# EAGLE design Pakfav7 (EAGLE 9.0.1)
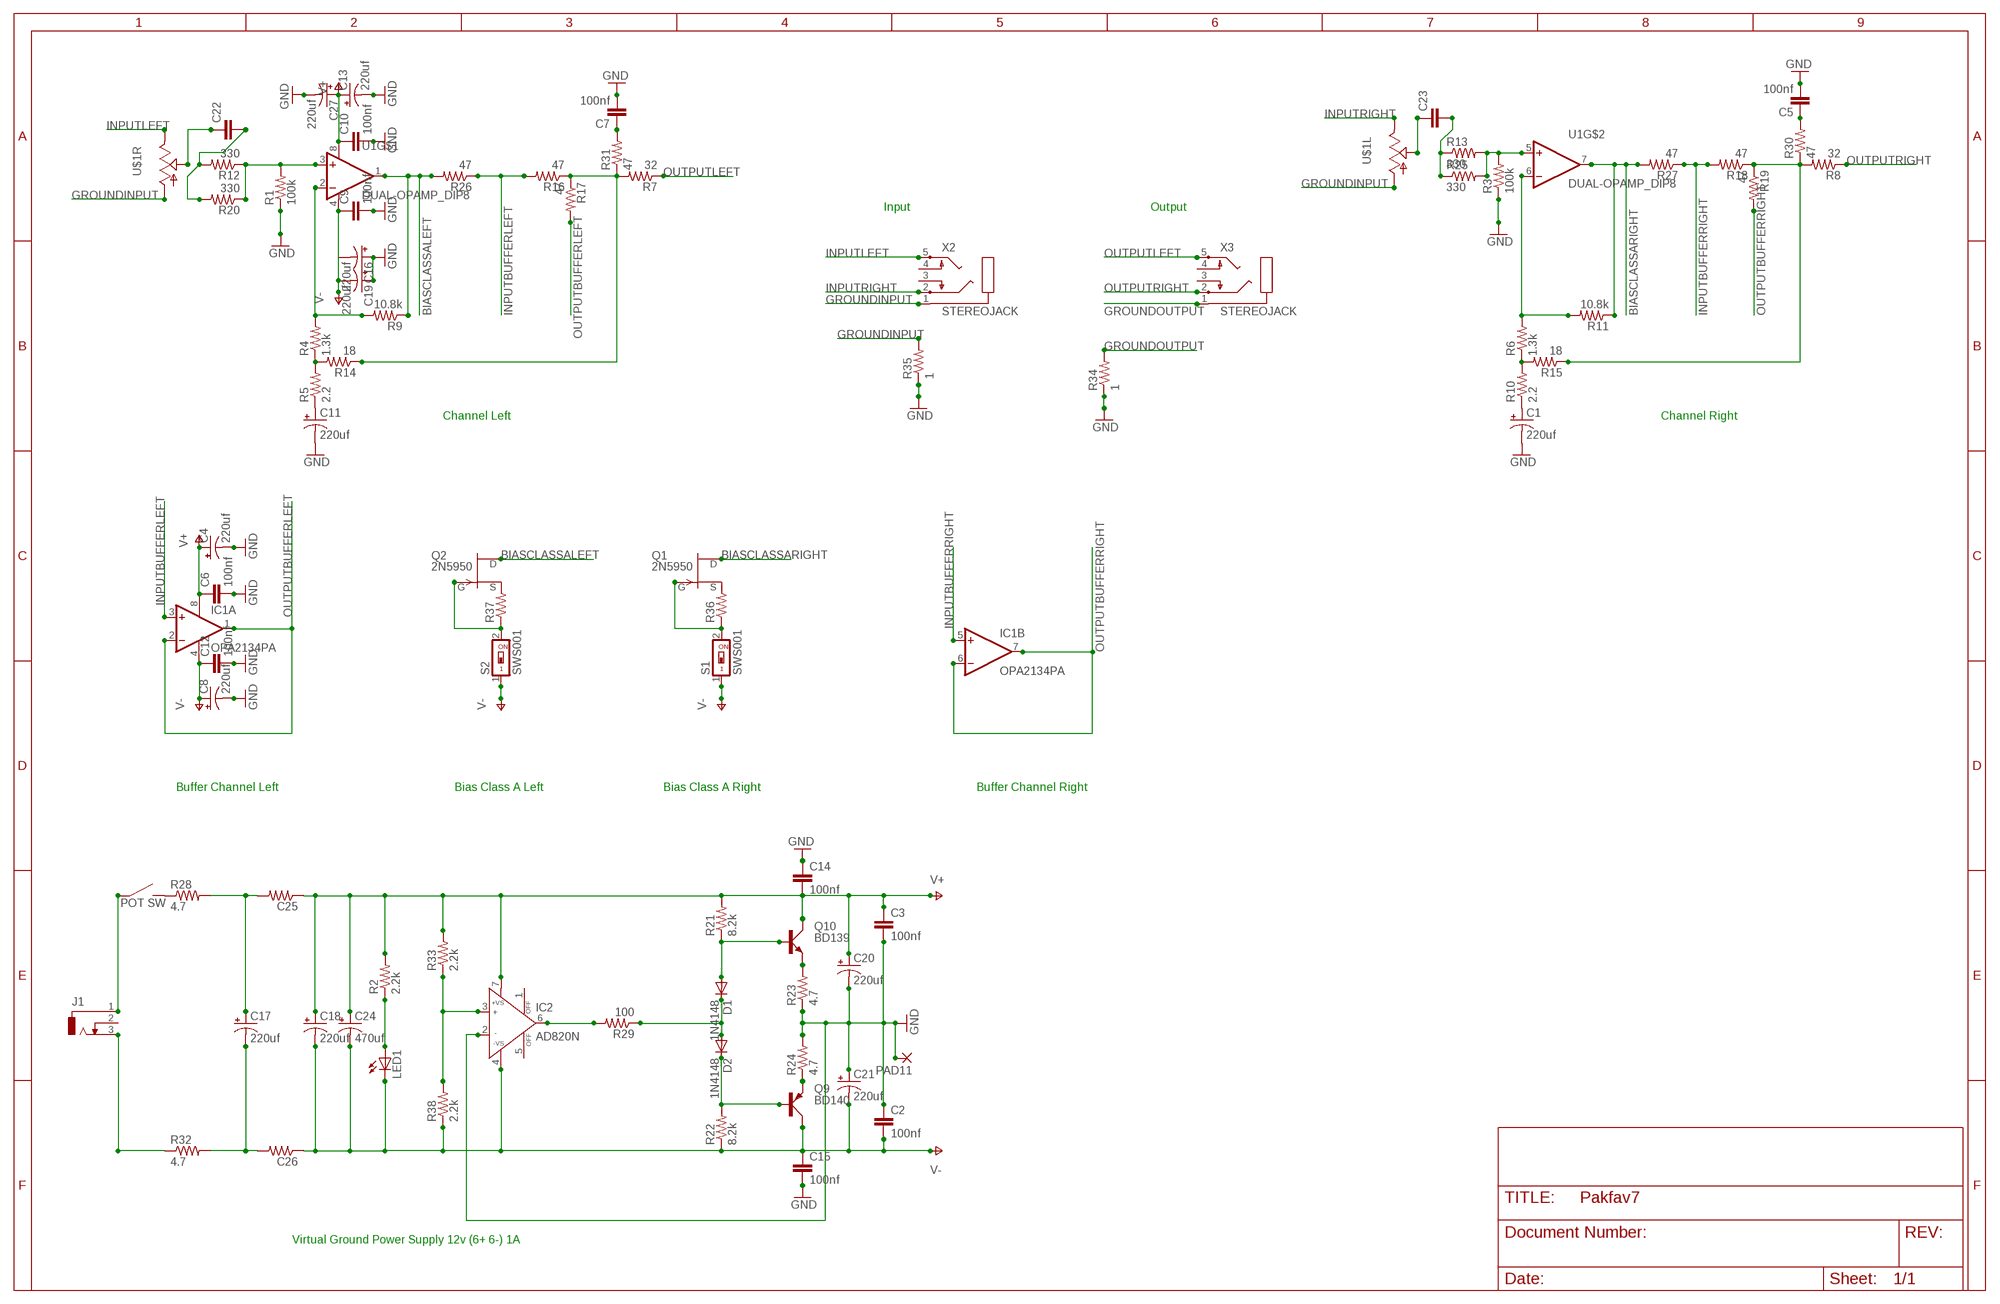
[diagram p0: schematic, sheet 1]

## Parts
C1  220uf  CPOL-USE5-10.5  [E5-10,5]
C2  100nf  C5/2.5  [C5B2.5]
C3  100nf  C5/2.5  [C5B2.5]
C4  220uf  CPOL-USE5-10.5  [E5-10,5]
C5  100nf  C5/2.5  [C5B2.5]
C6  100nf  C5/2.5  [C5B2.5]
C7  100nf  C5/2.5  [C5B2.5]
C8  220uf  CPOL-USE5-10.5  [E5-10,5]
C9  100nf  C5/2.5  [C5B2.5]
C10  100nf  C5/2.5  [C5B2.5]
C11  220uf  CPOL-USE5-10.5  [E5-10,5]
C12  100nf  C5/2.5  [C5B2.5]
C13  220uf  CPOL-USE5-10.5  [E5-10,5]
C14  100nf  C5/2.5  [C5B2.5]
C15  100nf  C5/2.5  [C5B2.5]
C16  220uf  CPOL-USE5-10.5  [E5-10,5]
C17  220uf  CPOL-USE3.5-10  [E3,5-10]
C18  220uf  CPOL-USE3.5-10  [E3,5-10]
C19  220uf  CPOL-USE5-10.5  [E5-10,5]
C20  220uf  CPOL-USD/7343-31R  [D/7343-31R]
C21  220uf  CPOL-USD/7343-31R  [D/7343-31R]
C22  C22/6  [C22.5B6]
C23  C22/6  [C22.5B6]
C24  470uf  CPOL-USE5-10.5  [E5-10,5]
C25  R-US_0207/12  [0207/12]
C26  R-US_0207/12  [0207/12]
C27  220uf  CPOL-USE5-10.5  [E5-10,5]
D1  1N4148  1N4148DO35-7  [DO35-7]
D2  1N4148  1N4148DO35-7  [DO35-7]
IC1  OPA2134PA  [DIL08]
IC2  AD820N  [DIL08]
J1  DCJ0303  [DCJ0303]
LED1  LED3MM  [LED3MM]
PAD11  1,6/0,9  [1,6/0,9]
Q1  2N5950  [TO-92]
Q2  2N5950  [TO-92]
Q9  BD140  [TO126AV]
Q10  BD139  [TO126AV]
R1  100k  R-US_0207/10  [0207/10]
R2  2.2k  R-US_0207/10  [0207/10]
R3  100k  R-US_0207/10  [0207/10]
R4  1.3k  R-US_0207/10  [0207/10]
R5  2.2  R-US_0204/5  [0204/5]
R6  1.3k  R-US_0207/10  [0207/10]
R7  32  R-US_0207/12  [0207/12]
R8  32  R-US_0207/12  [0207/12]
R9  10.8k  R-US_0207/10  [0207/10]
R10  2.2  R-US_0204/5  [0204/5]
R11  10.8k  R-US_0207/10  [0207/10]
R12  330  R-US_0207/10  [0207/10]
R13  330  R-US_0207/10  [0207/10]
R14  18  R-US_0207/12  [0207/12]
R15  18  R-US_0207/12  [0207/12]
R16  47  R-US_0207/12  [0207/12]
R17  47  R-US_0207/12  [0207/12]
R18  47  R-US_0207/12  [0207/12]
R19  47  R-US_0207/12  [0207/12]
R20  330  R-US_0207/10  [0207/10]
R21  8.2k  R-US_0207/10  [0207/10]
R22  8.2k  R-US_0207/10  [0207/10]
R23  4.7  R-US_0207/10  [0207/10]
R24  4.7  R-US_0207/10  [0207/10]
R25  330  R-US_0207/10  [0207/10]
R26  47  R-US_0207/10  [0207/10]
R27  47  R-US_0207/10  [0207/10]
R28  4.7  R-US_0207/10  [0207/10]
R29  100  R-US_0207/10  [0207/10]
R30  47  R-US_0207/7  [0207/7]
R31  47  R-US_0207/7  [0207/7]
R32  4.7  R-US_0207/10  [0207/10]
R33  2.2k  R-US_0207/10  [0207/10]
R34  1  R-US_0207/7  [0207/7]
R35  1  R-US_0207/7  [0207/7]
R36  R-US_0204/5  [0204/5]
R37  R-US_0204/5  [0204/5]
R38  2.2k  R-US_0207/10  [0207/10]
S1  SWS001  [SMS-001]
S2  SWS001  [SMS-001]
U1  DUAL-OPAMP_DIP8  [DIP-8]
U$1  ALPS_RK0971221Z05  [ALPS_RK0971221Z0X]
X2  STEREOJACK  [STX3100]
X3  STEREOJACK  [STX3100]

## Nets
BIASCLASSALEFT: Q2.3(D) R9.1 R26.2 U1.1(OUT)
BIASCLASSARIGHT: Q1.3(D) R11.1 R27.2 U1.7(OUT)
GND: C1.- C2.1 C3.2 C4.- C5.2 C6.2 C7.2 C8.- C9.2 C10.2 C11.- C12.2 C13.- C14.1 C15.2 C16.+ C19.+ C20.- C21.+ C27.- IC2.2(IN-) PAD11.1(P) R1.1 R3.1 R23.1 R24.2 R34.1 R35.1
GROUNDINPUT: R35.2 U$1.G1 U$1.G2 X2.1
GROUNDOUTPUT: R34.2 X3.1
INPUTBUFFERLEFT: IC1.3(A:+IN) R16.2 R26.1
INPUTBUFFERRIGHT: IC1.5(B:+IN) R18.2 R27.1
INPUTLEFT: U$1.I2 X2.5
INPUTRIGHT: U$1.I1 X2.2
N$1: R1.2 R12.1 R20.1 U1.3(+IN)
N$2: C1.+ R10.1
N$3: C22.2 R12.2 R20.2
N$4: C11.+ R5.1
N$5: IC2.6(OUT) R29.2
N$6: Q10.E R23.2
N$7: IC2.3(IN+) R33.1 R38.2
N$8: Q9.E R24.1
N$9: C22.1 U$1.O2
N$10: R3.2 R13.2 R25.2 U1.5(+IN)
N$11: C23.2 R13.1 R25.1
N$12: R4.1 R5.2 R14.2
N$13: R4.2 R9.2 U1.2(-IN)
N$14: R6.1 R10.2 R15.2
N$15: C23.1 U$1.O1
N$18: R6.2 R11.2 U1.6(-IN)
N$21: R28.1 U$1.S2
N$22: J1.3 R32.1
N$23: R8.2 R15.1 R18.1 R19.1 R30.1
N$24: R7.2 R14.1 R16.1 R17.1 R31.1
N$25: LED1.A R2.1
N$26: J1.1 U$1.S1
N$28: C5.1 R30.2
N$29: D1.A Q10.B R21.1
N$30: D2.C Q9.B R22.2
N$33: C17.+ C25.2 R28.2
N$36: D1.C D2.A R29.1
N$37: C7.1 R31.2
N$40: C17.- C26.2 R32.2
N$41: Q1.2(S) R36.2
N$43: Q2.1(G) R37.1 S2.2
N$44: Q1.1(G) R36.1 S1.2
N$45: Q2.2(S) R37.2
OUTPUTBUFFERLEFT: IC1.1(A:OUT) IC1.2(A:-IN) R17.2
OUTPUTBUFFERRIGHT: IC1.6(B:-IN) IC1.7(B:OUT) R19.2
OUTPUTLEFT: R7.1 X3.5
OUTPUTRIGHT: R8.1 X3.2
V+: C3.1 C4.+ C6.1 C10.1 C13.+ C14.2 C18.+ C20.+ C24.+ C25.1 C27.+ IC1.8(A:V+) IC2.7(+VS) Q10.C R2.2 R21.2 R33.2 U1.8(V+)
V-: C2.2 C8.+ C9.1 C12.1 C15.1 C16.- C18.- C19.- C21.- C24.- C26.1 IC1.4(A:V-) IC2.4(-VS) LED1.K(C) Q9.C R22.1 R38.1 S1.1 S2.1 U1.4(V-)
Unconnected: IC2.1(OFF) IC2.5(OFF) J1.2 X2.3 X2.4 X3.3 X3.4

## Notes on the sheet
- Input | Output
- Channel Left | Channel Right
- Buffer Channel Left | Bias Class A Left | Bias Class A Right | Buffer Channel Right
- Virtual Ground Power Supply 12v (6+ 6-) 1A

## Library data of the parts
C1 C4 C8 C11 C13 C16-C21 C24 C27 = rcl:CPOL-US: POLARIZED CAPACITOR, American symbol; SPICEPREFIX: C
C2 C3 C5-C7 C9 C10 C12 C14 C15 C22 C23 = capacitor-wima:C: CAPACITOR naming: grid - package width
C25 C26 R1 R3-R6 R9-R13 R20 R25 R30 R31 R34 R35 = resistor:R-US_: RESISTOR, American symbol
D1 D2 = diode:1N4148: DIODE high speed (Philips)
IC1 = linear:OPA2*: Dual Operational Amplifier Low Power, Single-Supply, Rail-To-Rail Operational Amplifier Source: http://focus.ti.com/lit/ds/symlink/opa2345.pdf http://focus.ti.com .. opa241.pdf http://focus.ti.com/lit/ds/symlink/opa2134.pdf
IC2 = analog-devices:AD820N: Single-Supply, Rail-to-Rail, Low Power, FET Input Op Amp Source: http://www.analog.com/static/imported-files/data_sheets/AD820.pdf; OC_FARNELL: 1438579; OC_NEWARK: unknown
J1 = con-jack:DCJ0303: DC POWER JACK Source: DCJ0303.pdf
LED1 = led:LED: LED OSRAM: - CHIPLED LG R971, LG N971, LY N971, LG Q971, LY Q971, LO R971, LY R971 LH N974, LH R974 LS Q976, LO Q976, LY Q976 LO Q996 - Hyper CHIPLED LW Q18S LB Q993, LB Q99A, LB R99A - SideLED LS A670, LO A670, LY A670, LG A670, LP A670 LB A673, LV A673, LT A673, LW A673 LH A674 LY A675 LS A676, LA A676, LO A676, LY A676, LW A676 LS A679, LY A679, LG A679 - Hyper Micro SIDELED® LS Y876, LA Y876, LO Y876, LY Y876 LT Y87S - SmartLED LW L88C, LW L88S LB L89C, LB L89S, LG L890 LS L89K, LO L89K, LY L89K LS L896, LA L896, LO L896, LY L896 - TOPLED LS T670, LO T670, LY T670, LG T670, LP T670 LSG T670, LSP T670, LSY T670, LOP T670, LYG T670 LG T671, LOG T671, LSG T671 LB T673, LV T673, LT T673, LW T673 LH T674 LS T676, LA T676, LO T676, LY T676, LB T676, LH T676, LSB T676, LW T676 LB T67C, LV T67C, LT T67C, LS T67K, LO T67K, LY T67K, LW E67C LS E67B, LA E67B, LO E67B, LY E67B, LB E67C, LV E67C, LT E67C LW T67C LS T679, LY T679, LG T679 LS T770, LO T770, LY T770, LG T770, LP T770 LB T773, LV T773, LT T773, LW T773 LH T774 LS E675, LA E675, LY E675, LS T675 LS T776, LA T776, LO T776, LY T776, LB T776 LHGB T686 LT T68C, LB T68C - Hyper Mini TOPLED® LB M676 - Mini TOPLED Santana® LG M470 LS M47K, LO M47K, LY M47K Source: http://www.osram.convergy.de LUXEON: - LUMILED® LXK2-PW12-R00, LXK2-PW12-S00, LXK2-PW14-U00, LXK2-PW14-V00 LXK2-PM12-R00, LXK2-PM12-S00, LXK2-PM14-U00 LXK2-PE12-Q00, LXK2-PE12-R00, LXK2-PE12-S00, LXK2-PE14-T00, LXK2-PE14-U00 LXK2-PB12-K00, LXK2-PB12-L00, LXK2-PB12-M00, LXK2-PB14-N00, LXK2-PB14-P00, LXK2-PB14-Q00 LXK2-PR12-L00, LXK2-PR12-M00, LXK2-PR14-Q00, LXK2-PR14-R00 LXK2-PD12-Q00, LXK2-PD12-R00, LXK2-PD12-S00 LXK2-PH12-R00, LXK2-PH12-S00 LXK2-PL12-P00, LXK2-PL12-Q00, LXK2-PL12-R00 Source: www.luxeon.com KINGBRIGHT: KA-3528ASYC Source: www.kingbright.com
PAD11 = wirepad:1,6/0,9: THROUGH-HOLE PAD
Q1 Q2 = transistor-fet:2N5950: N-Channel JFET RF Amplifier
Q9 = transistor-power:BD140: PNP TRANSISTOR
Q10 = transistor-power:BD139: NPN TRANSISTOR
R2 R7 R8 R14-R19 R21-R24 R26-R29 R32 R33 R36-R38 = resistor@1:R-US_: RESISTOR, American symbol
S1 S2 = smd-special:SWS001: SMD Dip Switch 1 pol.
U1 = opamps:DUAL-OPAMP: Generic 2-channel DIP-8 opamp
U$1 = audio-pots:ALPS_RK0971221Z0*: ALPS RK0971221Z Dual-gang 9mm potentiometer for volume control, with SPST switch -05 model: 10K with "volume" taper -0N model: 50K with traditional audio taper
X2 X3 = adafruit:STEREOJACK: MIC/HEADPHONE JACK Stereo jack with two switches. Kycon STX3100, CUI SJ1-3555NG and/or 4UCon 05544

## Board
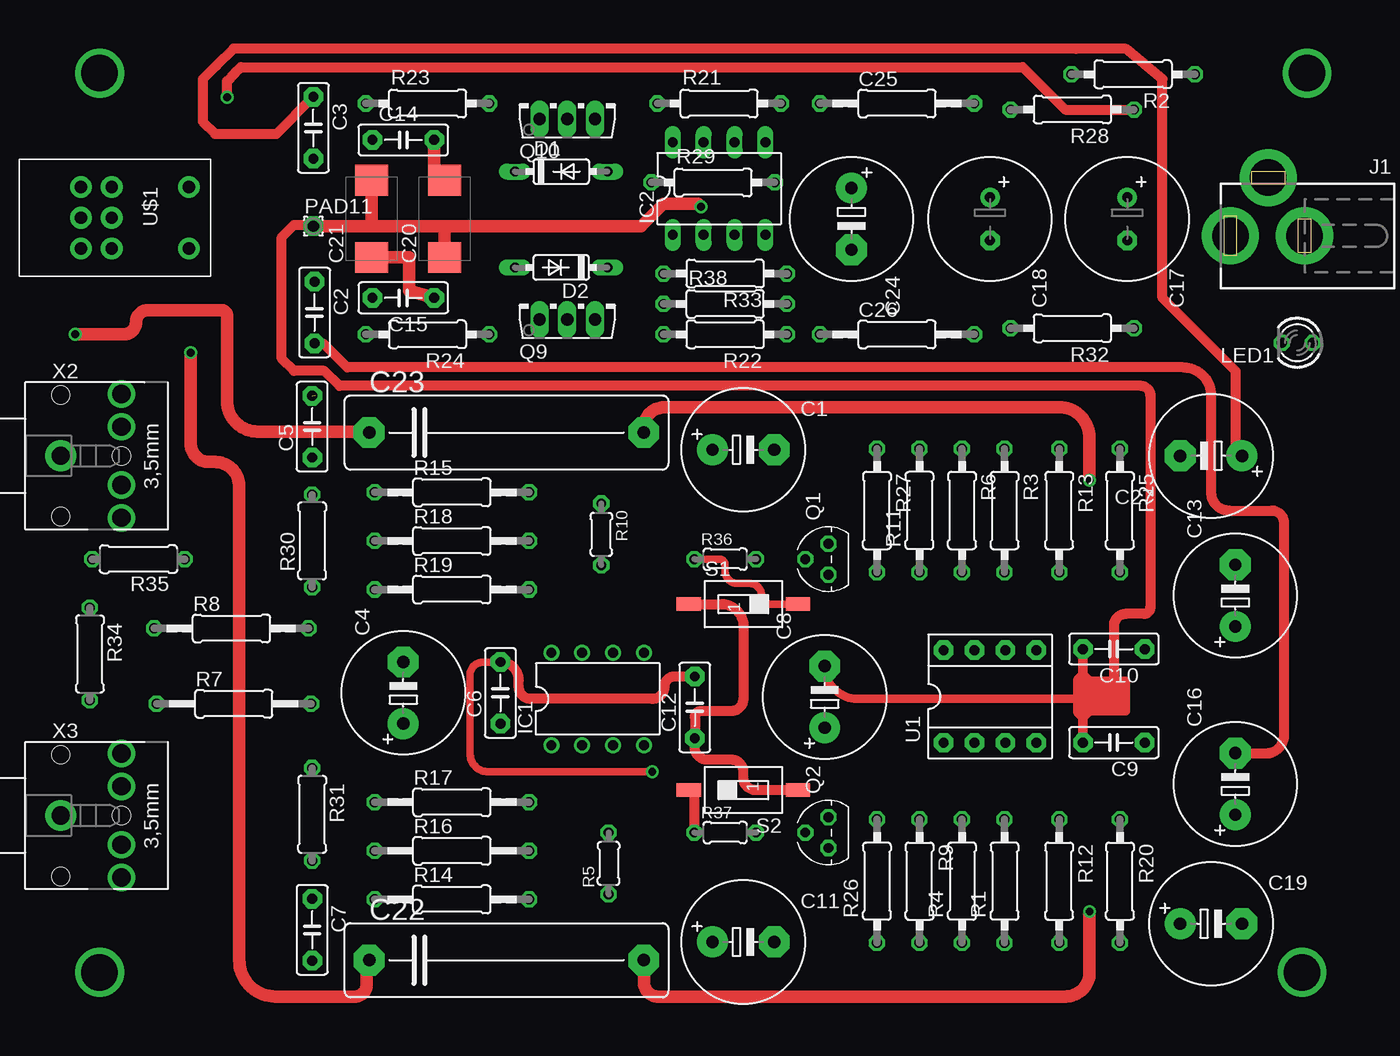
[diagram p1: board, top side]
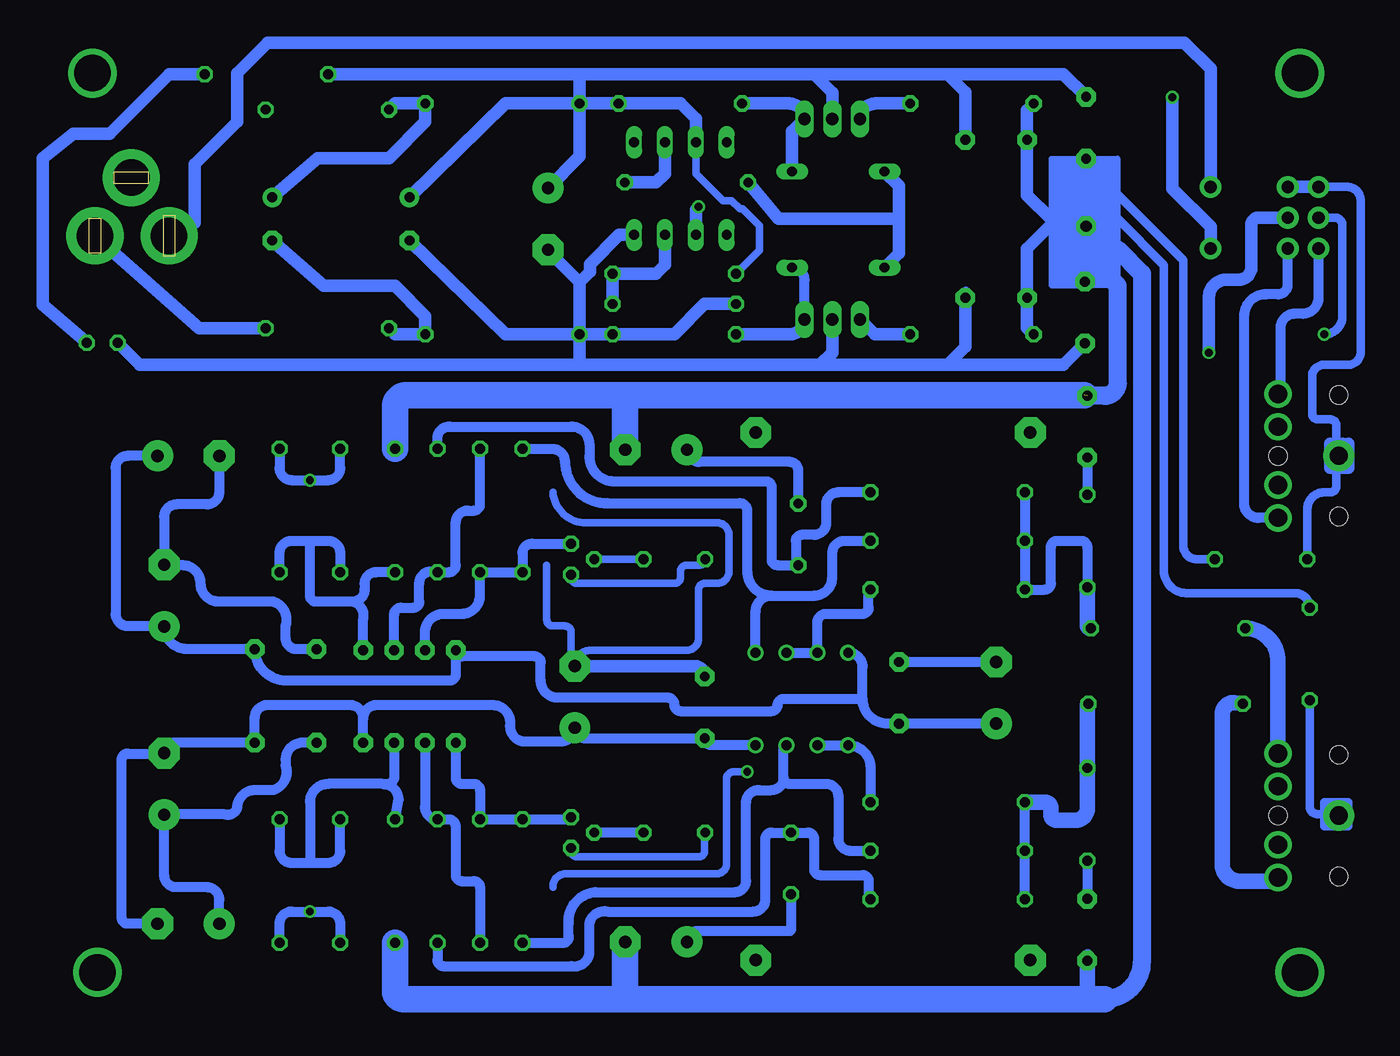
[diagram p2: board, bottom side, seen from below]

No outline drawn. Coordinates in mm, seen from the top.
Copper layers (1*16): Top 0.035mm / dielectric 1.5mm / Bottom 0.035mm
Design rules "default *": minimum track width 10mil, minimum drill 24mil, track to track 28mil, track to pad 28mil, pad to pad 28mil, via to via 28mil, smd to smd 8mil, copper to edge 40mil, drill to drill 8mil, minimum pad ring 10mil, minimum via ring 8mil, stop-mask expansion 4mil, vias tented up to drill 0mil, thermal gap 10mil

### Footprints (pad centres in the part's own frame; a part is rotated, then mirrored left to right if it is on the bottom)
E5-10,5 = drill 1.016 pad 2.54: + -2.54,0 | drill 1.016 pad 2.54 octagon: - 2.54,0
C5B2.5 = drill 0.813 pad 1.6 octagon: 1 -2.54,0; 2 2.54,0
E3,5-10 = drill 0.813 pad 1.6: + -1.778,0 | drill 0.813 pad 1.6 octagon: - 1.778,0
D/7343-31R = smd 2.55 x 2.7: + 3.175,0; - -3.175,0
C22.5B6 = drill 1.016 pad 2.54 octagon: 1 -11.303,0; 2 11.303,0
0207/12 = drill 0.813 octagon: 1 -6.35,0; 2 6.35,0
DO35-7 = drill 0.813 long: A 3.81,0; C -3.81,0
DIL08 = drill 0.813 pad 1.27: 1 -3.81,-3.81; 2 -1.27,-3.81; 3 1.27,-3.81; 4 3.81,-3.81; 5 3.81,3.81; 6 1.27,3.81; 7 -1.27,3.81; 8 -3.81,3.81
DIL08' = drill 0.813 long: 1 -3.81,-3.81; 2 -1.27,-3.81; 3 1.27,-3.81; 4 3.81,-3.81; 5 3.81,3.81; 6 1.27,3.81; 7 -1.27,3.81; 8 -3.81,3.81
DCJ0303 = drill 3 pad 4.7: 1 0,3.1; 2 4.8,0; 3 0,-3
LED3MM = drill 0.813 octagon: A -1.27,0; K 1.27,0
1,6/0,9 = drill 0.914 pad 1.6 octagon: 1 0,0
TO-92 = drill 0.813 octagon: 1 -1.27,0; 2 0,1.905; 3 1.27,0
TO126AV = drill 1.016 long: B 2.286,-1.27; C 0,-1.27; E -2.286,-1.27
0207/10 = drill 0.813 octagon: 1 -5.08,0; 2 5.08,0
0204/5 = drill 0.813 octagon: 1 -2.54,0; 2 2.54,0
0207/7 = drill 0.813 octagon: 1 -3.81,0; 2 3.81,0
SMS-001 = smd 1.092 x 2.007: 1 0,-4.496; 2 0,4.496
DIP-8 = drill 0.813 pad 1.6 octagon: 1 -3.81,3.81; 2 -3.81,1.27; 3 -3.81,-1.27; 4 -3.81,-3.81; 5 3.81,-3.81; 6 3.81,-1.27; 7 3.81,1.27; 8 3.81,3.81
ALPS_RK0971221Z0X = drill 1.016 pad 1.778: G1 2.54,-2.54; G2 0,-2.54; I1 2.54,2.54; I2 0,2.54; O1 2.54,0; O2 0,0; S1 -6.35,-2.54; S2 -6.35,2.54
STX3100 = drill 1.5 pad 2.54: 1 2.7,-0.1 | drill 1.5: 2 7.7,5; 3 7.7,2.3; 4 7.7,-2.5; 5 7.7,-5.2 | hole 1.5: 2.7,4.9; 2.7,-5.1; 7.7,-0.1

### Placement (x,y rotation side)
C1  79,70 0 top
C2  43.7,81.3 270 top
C3  43.6,96.5 270 top
C4  51,50 90 top
C5  43.5,71.9 90 top
C6  59,50 90 top
C7  43.5,30.5 270 top
C8  85.7,49.66 90 top
C9  109.5,45.9 180 top
C10  109.5,53.6 180 top
C11  79,29.5 0 top
C12  75,48.8 90 top
C13  119.5,58 90 top
C14  51,95.5 0 top
C15  51,82.5 180 top
C16  119.5,42.5 90 top
C17  110.6,89 270 top
C18  99.3,89 270 top
C19  117.5,31 0 top
C20  54.4,89 90 top
C21  48.4,89 90 top
C22  59.5,28 0 top
C23  59.5,71.42 0 top
C24  87.9,89 270 top
C25  91.65,98.5 0 top
C26  91.65,79.5 0 top
C27  117.5,69.5 180 top
D1  64,92.9 0 top
D2  64,85 180 top
IC1  67,49.5 0 top
IC2  AD820N  [DIL08']  77,91.5 0 top
J1  122.2,87.6 90 top
LED1  124.6,78.8 180 top
PAD11  43.6,88.4 0 top
Q1  86,61 90 top
Q2  86,38.5 90 top
Q9  64.5,82 0 top
Q10  64.5,98.5 0 top
R1  100.5,34.5 90 top
R2  111.08,100.9 180 top
R3  100.5,65 270 top
R4  97,34.5 90 top
R5  67.9,35.96 90 top
R6  97,65 270 top
R7  37.05,49.1 0 top
R8  36.85,55.3 0 top
R9  93.5,34.5 270 top
R10  67.3,63.04 270 top
R11  93.5,65 90 top
R12  105,34.5 270 top
R13  105,65 270 top
R14  55,33 0 top
R15  55,66.5 0 top
R16  55,37 0 top
R17  55,41 0 top
R18  55,62.5 0 top
R19  55,58.5 0 top
R20  110,34.5 270 top
R21  77,98.5 0 top
R22  77.5,79.5 180 top
R23  53,98.5 0 top
R24  53,79.5 180 top
R25  110,65 270 top
R26  90,34.5 90 top
R27  90,65 270 top
R28  106.08,98 180 top
R29  76.5,92 0 top
R30  43.5,62.5 90 top
R31  43.5,40 270 top
R32  106.08,80 180 top
R33  77.5,84.5 180 top
R34  25.2,53.2 270 top
R35  29.2,61 180 top
R36  77.5,61 0 top
R37  77.5,38.5 0 top
R38  77.5,82 0 top
S1  79,57.3 270 top
S2  79,42 90 top
U1  99.3,49.7 90 top
U$1  27,89.1 180 top
X2  20.1,69.6 0 top
X3  20.1,40 0 top

### Tracks (layer width: path | path; a pad name or v marks a point on that pad's centre or on a via)
BIASCLASSALEFT
  Bottom 0.813: U1.1 95.49,42.99 arc-90 95,42.5 94,42.5 arc90 93.5,42 R9.1 R26.2 86.19,39.58 arc-90 Q2.3
BIASCLASSARIGHT
  Bottom 0.813: U1.7 98.03,54.97 arc90 96.5,56.5 95,56.5 arc-90 93.5,58 R11.1 R27.2 90,61.5 arc90 89.23,62.27 Q1.3
GND  (via drill 0.65 pad 0.6)  (1 unrouted)
  Top 0.61: v71.5,43.5 58,43.5 arc-90 56.5,45 56.5,51.5 arc-90 57.5,52.5 58.96,52.5 arc90 C6.2
  Top 0.7: 110.5,50.5 110.5,51 107.5,51 106.96,51.54 106.71,51.29 | 110.5,50.5 110.5,50 | 110.5,50 110.5,48.5 107.5,48.5 106.96,47.96 106.71,48.21 | 110.5,50.5 109.5,50.5 107.5,50.5 | 107.5,50.5 108,50 109.5,50 | 109.5,50 110,50 | 110,50 110.5,50 | 110,50 110,49 107.5,49 | 107.5,49 107.5,49.5 | 107.5,49.5 107.5,50.5 | 107.5,49.5 109.5,49.5 109.5,50 | 106.71,48.21 106.5,48.42 106.5,49 | 106.71,51.29 106.5,51.08 106.5,50.5 | 106.5,49 106.5,49.5 | 106.5,49.5 106.5,50.5 | 106.71,51.29 107.25,50.75 | 107.25,50.75 107.5,50.5 | 107.25,50.75 107,50.5 | 107,50.5 106.5,50.5 | 107,50.5 107,49.5 107.5,49 | 107.5,49 107,49 | 107,49 106.5,49 | 107,49 107,48.5 106.71,48.21 | 106.5,49.5 88.4,49.5 arc-90 C8.-
  Top 0.8: C10.2 106.96,51.54 | 106.96,47.96 C9.2
  Top 0.813: C12.2 73.34,51.34 arc90 72.5,50.5 arc-90 71.5,49.5 61.5,49.5 arc-90 60.5,50.5 60.5,51.04 arc90 C6.2 | PAD11.1 arc90 43.5,88.5 42,88.5 41,87.5 41,77.5 42,76.5 44.5,76.5 45.75,75.25 111.75,75.25 arc-90 112.5,74.5 112.5,57 arc-90 112,56.5 110.5,56.5 arc90 109.5,55.5 109.5,50.5
  Top 1.016: C20.- 54.4,88.4 | 54.4,88.4 48.4,88.4 | 48.4,88.4 PAD11.1 | C21.+ 48.4,88.4 | 54.4,88.4 70.58,88.4 72.41,90.23 75.27,90.23 v75.5,90
  Bottom 0.406: 41,88.4 41,94 43.6,94 C3.2 46.5,93.96 46.5,89 46.5,83.5 43.7,83.5 | PAD11.1 41,88.4 | 41,88.4 41,86.5 41,83.5 43.7,83.5 | 43.7,83.5 C2.1
  Bottom 0.61: 87.5,34 arc90 86.5,35.1 74,35.1 arc-90 73.2,36 73.2,43 arc90 72.5,43.5 v71.5,43.5 | C12.2 75,51.5 | 87.5,66.5 arc-90 84.5,64 74,64 arc90 73,63 73,60 arc90 74,59 75,59 arc-90 75.5,58.5 75.5,54.5 arc90 76.5,53.5 84.4,53.5 arc-90 C8.- 85.2,52.2 arc90 86,53 86,55 arc-90 86.5,55.5 87.5,55.5 arc90 88,56 88,60.5
  Bottom 0.7: R34.1 arc-90 26.39,58.2 35.4,58.2 arc90 37.2,60.2 37.2,85.2 41,89 41.5,89 | R35.1 34.4,61 arc90 35.6,62 35.6,85.6 41.5,91.5
  Bottom 0.813: 81.54,74.04 arc-90 82,74.5 | C6.2 C4.- | C10.2 108.6,53.6 arc90 109.5,54.5 109.5,55.5 arc-90 110.5,57.5 115,57.5 arc90 116.5,59 arc-90 118,60.5 119.46,60.5 arc90 C13.- 119.5,64.5 arc90 118.5,65.5 116,65.5 arc-90 114.96,66.54 C27.- | C9.2 108.1,45.9 arc-90 109.5,44.5 109.5,44 arc90 110.5,42 112,42 arc-90 113.5,40.5 arc90 114.5,40 119.46,40 | 119.46,40 arc-90 C16.+ | C7.2 43.46,28.5 | 81.54,24.84 81.5,24.8 | C19.+ 114.96,32.96 arc-90 116,34 118.5,34 arc90 119.5,35 C16.+ | C16.+ arc90 119.46,40
  Bottom 1.016: C8.- 75.86,52.2 arc90 C12.2 | 55,74 arc-90 55.5,74.5 | R23.1 48.46,97.96 C14.1 48.46,90.96 46.5,89 | R24.2 48.46,80.04 C15.2 48.46,86.54 46,89 | v75.5,90 75.73,89.77 IC2.2
  Bottom 1.27: C3.2 43.6,93.5 41.5,93.5 41.5,91.5 41.5,89 41.5,84 46,84 46,89 46,93.5 42.5,93.5 42.5,85 45,85 45,92.5 43,92.5 43,86 | 43,85.5 43,86 | 43,86 44,86 44,91.5 43.6,91.5 PAD11.1 | C7.2 43.5,24.8
  Bottom 1.5: 42.1,24.8 arc-90 39,27.9 39,84.5 41,86.5 | 42.5,85 41,83.5 41,75.5 arc90 42.06,74.44 C5.2
  Bottom 2.184: 42.1,24.8 43.5,24.8 81.5,24.8 99.8,24.8 arc90 100.5,25.5 R1.1 | 43.76,74.5 55.5,74.5 82,74.5 99.5,74.5 arc-90 100.5,73.5 R3.1 | C1.- 81.54,74.04 | C11.- 81.54,24.84
GROUNDINPUT
  Bottom 0.7: U$1.G1 22.14,91.64 arc90 21,90.5 21,78 arc90 22,77 24,77 arc-90 25,76 25,73 arc-90 24.5,72.5 23.5,72.5 arc90 23,72 23,70.5 | R35.2 25.39,65.11 arc90 24,66.5 23.5,66.5 arc-90 23,67 23,68.5
  Bottom 1: 22.5,69.5 22.5,70.5 23,70.5 23.5,70.5 23.5,68.5 23,68.5 22,68.5 22,70.5 22.8,70.5 X2.1 22.5,69.5 | 22.5,69 22.5,69.5
  Bottom 1.016: U$1.G2 U$1.G1
GROUNDOUTPUT
  Bottom 0.7: R34.2 25.2,41.2 25.2,40.7 arc-90 24.5,40 23.5,40 | 22.8,41 X3.1 22.8,40.5 22.5,40.5 22.5,39.5 23.5,39.5 23.5,40 | 23.5,41 24,41 24,39 22,39 22,41 22.8,41 | 22.8,41 23.5,41 | 23.5,41 23.5,40
INPUTBUFFERLEFT
  Bottom 0.813: R26.1 86.58,29.42 arc-90 86.2,30 86.2,31 arc90 84,33.6 72.5,33.6 arc-90 71.6,34.5 71.6,41 arc90 70.5,42 69.5,42 arc-90 68.5,43 | 68.5,43 68.5,45.46 arc90 IC1.3 | 68.5,43 arc-90 68,42.5 65,42.5 arc90 64,41.5 64,38 arc-90 63,37 R16.2
INPUTBUFFERRIGHT
  Bottom 0.813: R27.1 87.58,70.08 arc90 86.5,69 arc-90 83,65.6 72.1,65.6 arc90 71.5,65 71.5,60 arc-90 69.5,58 | IC1.5 70.81,56.69 arc90 69.5,58 | 69.5,58 66,58 arc-90 64.5,59.5 64.5,61.5 arc90 63.5,62.5 R18.2
INPUTLEFT
  Bottom 0.813: X2.5 29.4,64.4 arc90 30.6,65.6 30.6,81 arc90 28.8,82.8 27.8,82.8 arc-90 27,83.6 U$1.I2
INPUTRIGHT
  Bottom 0.813: U$1.I1 24.46,82.54 arc90 25.8,81.2 26.4,81.2 arc-90 27.6,80 27.6,74.8 arc90 X2.2
N$1
  Bottom 0.813: R20.1 110,37 arc-90 109,36 107.5,36 | 107.5,36 106,36 arc-90 105,37 R12.1 | U1.3 100.57,42.93 arc90 101.5,42.5 | 101.5,42.5 106,42.5 arc-90 107.5,41 107.5,36 | R1.2 100.2,41.2 arc-90 101.5,42.5
N$2
  Bottom 0.813: R10.1 67.3,68.3 arc-90 68,69 75.46,69 arc90 C1.+
N$3  (via drill 0.65 pad 0.65)
  Top 1.016: C22.2 70.8,26.2 arc90 72,25 105.5,25 arc90 107.5,27 v107.5,32
  Bottom 0.813: R20.2 110,31 arc90 109,32 v107.5,32 106,32 arc90 105,31 R12.2
N$4
  Bottom 0.813: C11.+ arc90 75.46,30.4 68,30.4 arc-90 67.9,30.6 R5.1
N$5
  Bottom 1.016: IC2.6 78.27,92.73 79,92 R29.2
N$6
  Bottom 1.016: R23.2 60.94,98.5 arc-90 Q10.E
N$7
  Bottom 1.016: R38.2 R33.1 79,84.5 78.27,85.23 IC2.3
N$8
  Bottom 1.016: R24.1 60.98,79.5 Q9.E
N$9  (via drill 0.65 pad 0.65)
  Top 1.016: v33.5,78 33.5,70.5 arc90 35,69 35.5,69 arc-90 37.5,67 37.5,28 arc90 40.5,25 47,25 arc90 48,26 48,27.8 arc-90 C22.1
  Bottom 1.016: U$1.O2 29.4,89.1 arc-90 30,88.5 30,85 arc90 31,84 32,84 arc-90 33.5,82.5 v33.5,78
N$10
  Bottom 0.813: R25.2 110,61.5 arc90 109,62.5 107.5,62.5 | 107.5,62.5 106,62.5 arc90 105,61.5 R13.2 | U1.5 103.11,56.11 arc-90 104,57.5 | 104,57.5 107,57.5 arc90 107.5,58 107.5,62.5 | R3.2 102.08,59.92 arc-90 103,59 103,58.5 arc90 104,57.5
N$11  (via drill 0.65 pad 0.65)
  Top 1.016: C23.2 70.8,71.8 arc-90 72.5,73.5 105,73.5 arc-90 107.5,71 v107.5,67.5
  Bottom 0.813: R25.1 110,68.5 arc-90 109,67.5 v107.5,67.5 106,67.5 arc-90 105,68.5 R13.1
N$12
  Bottom 0.813: R4.1 97,28 arc-90 96.5,27.5 86,27.5 arc-90 84.5,28.5 84.5,31 arc90 83,32 71,32 arc-90 70,33 70,38 arc90 69.5,38.5 R5.2 66.5,38.5 arc90 66,38 66,35.5 arc-90 65.5,35 62,35 arc90 61.5,34.5 61.5,33.15 arc-90 R14.2
N$13
  Bottom 0.813: U1.2 98.03,40.61 arc-90 R4.2 96.08,39.58 arc90 95.5,39 95.5,35 arc-90 95,34.5 94,34.5 arc90 93.5,34 R9.2
N$14
  Bottom 0.813: R6.1 97,71 arc90 96,71.9 86,71.9 arc90 84.5,70.5 84.5,69.5 arc-90 82.5,67.4 70,67.4 arc90 69.5,67 69.5,61 arc-90 69,60.5 R10.2 arc90 67.5,60.7 67.5,62.5 arc90 67,63 66,63 arc-90 65,64 65,65.5 arc90 64,66.5 R15.2
N$15  (via drill 0.65 pad 0.65)
  Top 1.016: v24,79.5 28,79.5 arc90 29,80.5 arc-90 30,81.5 36,81.5 arc-90 36.5,81 36.5,74 arc90 39,71.5 48.12,71.5 arc-90 C23.1
  Bottom 0.7: U$1.O1 23.1,89.1 arc90 22.5,88.5 22.5,81 arc90 v24,79.5
N$18
  Bottom 0.813: U1.6 100.57,56.43 arc90 100,57 99,57 arc-90 98.5,57.5 98.5,59 arc90 97.5,60 97.08,60 arc90 R6.2 96.08,59.92 arc-90 95.5,60.5 95.5,64 arc90 94.5,65 94,65 arc-90 93.5,65.5 R11.2
N$21  (via drill 0.65 pad 0.9)
  Top 0.813: v36.5,99 36.5,100.34 37.13,100.97 37.65,101.5 102,101.5 105.5,98 R28.1
  Bottom 1.016: U$1.S2 33.35,88.35 36.5,91.5 v36.5,99
N$22
  Bottom 1.016: R32.1 116.6,80 J1.3
N$23
  Bottom 0.813: R15.1 R18.1 R19.1 47,58.5 arc-90 46.5,59 46.5,62 arc90 46,62.5 44,62.5 arc90 43.5,62 R30.1
  Bottom 1.27: R30.1 43.5,55.6 arc-90 R8.2
N$24
  Bottom 0.813: 43.5,49 arc90 R7.2 | R14.1 R16.1 R17.1
  Bottom 1.27: 43.5,49 R31.1 43.5,40.5 arc90 44.5,39.5 46,39.5 arc90 46.5,40 46.5,40.5 arc-90 47,41 R17.1
N$25
  Bottom 0.813: 126.07,79 arc90 LED1.A | 116.26,101 arc90 R2.1
  Bottom 1.016: R2.1 119.1,100.9 124,96 127,96 129.5,94 129.5,81.93 126.07,79
N$26
  Bottom 1.016: U$1.S1 33.35,101.35 35.5,103.5 111,103.5 113.5,101 113.5,97 117,93.5 117,88.7 J1.1
N$27  (via drill 3 pad 3.81)
  other vias: 125,27
N$28
  Bottom 0.813: C5.1 R30.2
N$29
  Bottom 1.016: R21.1 68.06,98.5 arc90 Q10.B 67.81,96.21 D1.A
N$30
  Bottom 0.813: Q9.B 66.79,83.98 arc-90 D2.C
  Bottom 1.016: R22.2 68.02,79.5 arc-90 Q9.B
N$32
  cutout Bottom: 20,105 132,105 132,22 20,22
N$33
  Bottom 1.016: C17.+ 106.88,94 101,94 98,97 C25.2 100.5,98.5 R28.2
N$34  (via drill 3 pad 3.81)
  other vias: 125.4,101
N$35  (via drill 3 pad 3.81)
  other vias: 26,101
N$36
  Bottom 1.016: R29.1 68.92,89 59,89 | D2.A 59,86.19 59,89 | 59,89 59,91.71 D1.C
N$37
  Bottom 0.813: R31.2 C7.1
N$38  (via drill 3 pad 3.81)
  other vias: 26,27
N$40
  Bottom 1.016: C17.- 106.38,83.5 100.5,83.5 98,81 C26.2 100.5,79.5 R32.2
N$41
  Bottom 0.61: R36.2 Q1.2
N$43
  Top 0.813: R37.1 74.96,41.54 arc90 S2.2
  Bottom 0.61: Q2.1 86,37 arc-90 85.5,36.5 75.5,36.5 arc-90 75,37 75,37.96 arc90 R37.1
  Bottom 0.813: 75,38.46 arc90 R37.1
N$44
  Top 0.61: S1.2 81.2,57.3 arc-90 80.5,58 arc90 79.5,59 78.5,59 arc-90 77.5,60 77.5,60.5 arc90 77,61 R36.1
  Bottom 0.61: Q1.1 86,59.5 arc-90 85.5,59 77.5,59 arc-90 77,59.5 77,60 arc90 76.5,60.5 75.46,60.5 arc-90 R36.1
N$45
  Bottom 0.813: R37.2 Q2.2
OUTPUTBUFFERLEFT
  Bottom 0.813: IC1.2 IC1.1 arc90 61.35,43.85 R17.2
OUTPUTBUFFERRIGHT
  Bottom 0.61: 65.5,53.54 arc90 IC1.7
  Bottom 0.813: IC1.6 IC1.7 65.73,55.77 arc90 65,56.5 62,56.5 arc-90 61.5,57 61.5,58.35 arc90 R19.2
OUTPUTLEFT
  Bottom 1.27: R7.1 31.4,49.2 arc-90 32.4,48.2 32.4,35.9 arc-90 31,34.5 28.1,34.5 arc-90 X3.5
OUTPUTRIGHT
  Bottom 1.27: R8.1 arc90 27.8,52.6 X3.2
V+
  Top 0.813: C3.1 40.56,96 35.5,96 34.5,97 34.5,100.5 35.6,101.6 35.6,101.61 37.02,103.02 103.87,103.02 106.39,103 110.5,103 113.5,100.5 113.5,82.5 119.5,76.5 119.5,70.04 arc90 C27.+
  Top 1.016: C20.+ 53.54,92.17 C14.2
  Bottom 0.61: 43.56,99 arc90 C3.1 | R33.2 70.5,86.42 70.5,88.42 71.9,89.82 72.11,89.82 72.79,90.5 73.5,90.5 75.73,92.73 IC2.7
  Bottom 0.813: C4.+ C6.1 59.96,47.46 arc90 62,49.5 | 62,49.5 62,52.12 arc-90 IC1.8 | 62,49.5 68.5,49.5 arc-90 69,49 arc90 69.5,48.5 77,48.5 arc90 77.5,49 arc-90 78,49.6 87.1,49.6 arc90 88.5,51 88.5,52.5 arc-90 89,53 94.98,53 arc90 U1.8 95.49,51.51 arc90 96,51 109.44,51 arc90 C10.1 117.64,53.6 arc90 C13.+ arc-90 119.54,55.5 122.5,55.5 arc90 123.5,56.5 123.5,68.5 arc90 122.5,69.5 C27.+
  Bottom 1.016: R2.2 85.5,100.9 | 85.5,100.9 66,100.9 | 66,100.9 55,100.9 | 55,100.9 45.46,100.9 C3.1 | C14.2 53.54,99.44 55,100.9 | Q10.C 64.5,99.4 66,100.9 | IC2.7 75.73,97.23 77,98.5 R21.2 C25.1 | C25.1 85.3,94.14 C24.+ | C18.+ 91.38,98.5 C25.1 | C25.1 85.3,100.7 85.5,100.9
V-
  Top 0.813: S2.1 80,42 arc-90 79,43 79,43.5 arc90 78,44.5 76,44.5 arc-90 75,45.5 C12.1 75,48 arc-90 75.5,48.5 78,48.5 arc90 79,49.5 79,55.5 arc90 77.2,57.3 S1.1 | C16.- arc90 119.54,45 122,45 arc90 123.5,46.5 123.5,64 arc90 122.5,65 119,65 arc-90 117.5,66.5 117.5,74.5 arc90 115.22,76.78 46.38,76.78 44.4,78.76 C2.2
  Top 1.016: C21.- 51.5,85.83 51.5,83.1 C15.1
  Bottom 0.61: 103.12,46.4 arc90 U1.4 | 53.5,83.14 arc90 C15.1
  Bottom 0.813: U1.4 103.11,47.89 | 103.11,47.89 arc90 102,49 92.5,49 arc90 91,47.5 arc-90 90,46 86.82,46 arc-90 C8.+ arc-90 84.84,46.26 C12.1 arc-90 74.43,45.69 IC1.4 | 103.11,47.89 arc-90 104.22,49 111,49 arc-90 112.04,47.96 C9.1 118.64,45.9 arc-90 C16.- arc90 119.54,45 122.5,45 arc-90 123,44.5 123,31.5 arc-90 122.5,31 C19.-
  Bottom 1.016: C26.1 R22.1 77.5,79.5 75,82 R38.1 | LED1.K 121.53,77 85.5,77 | C2.2 45.46,77 55,77 | 85.5,77 65.5,77 | 65.5,77 55,77 | C15.1 53.54,78.46 55,77 | Q9.C 64.5,78 65.5,77 | C24.- 87.9,86.4 85.3,83.8 | 85.3,83.8 C26.1 | 85.3,83.8 84.46,84.64 84.46,85.28 82.05,87.69 IC2.4 | C18.- 91.38,79.5 C26.1 | C26.1 85.3,77.2 85.5,77